# Altium schematic sheet H723ZG_Interface.SchDoc
size A; SheetNumber: 6; SheetTotal: 6
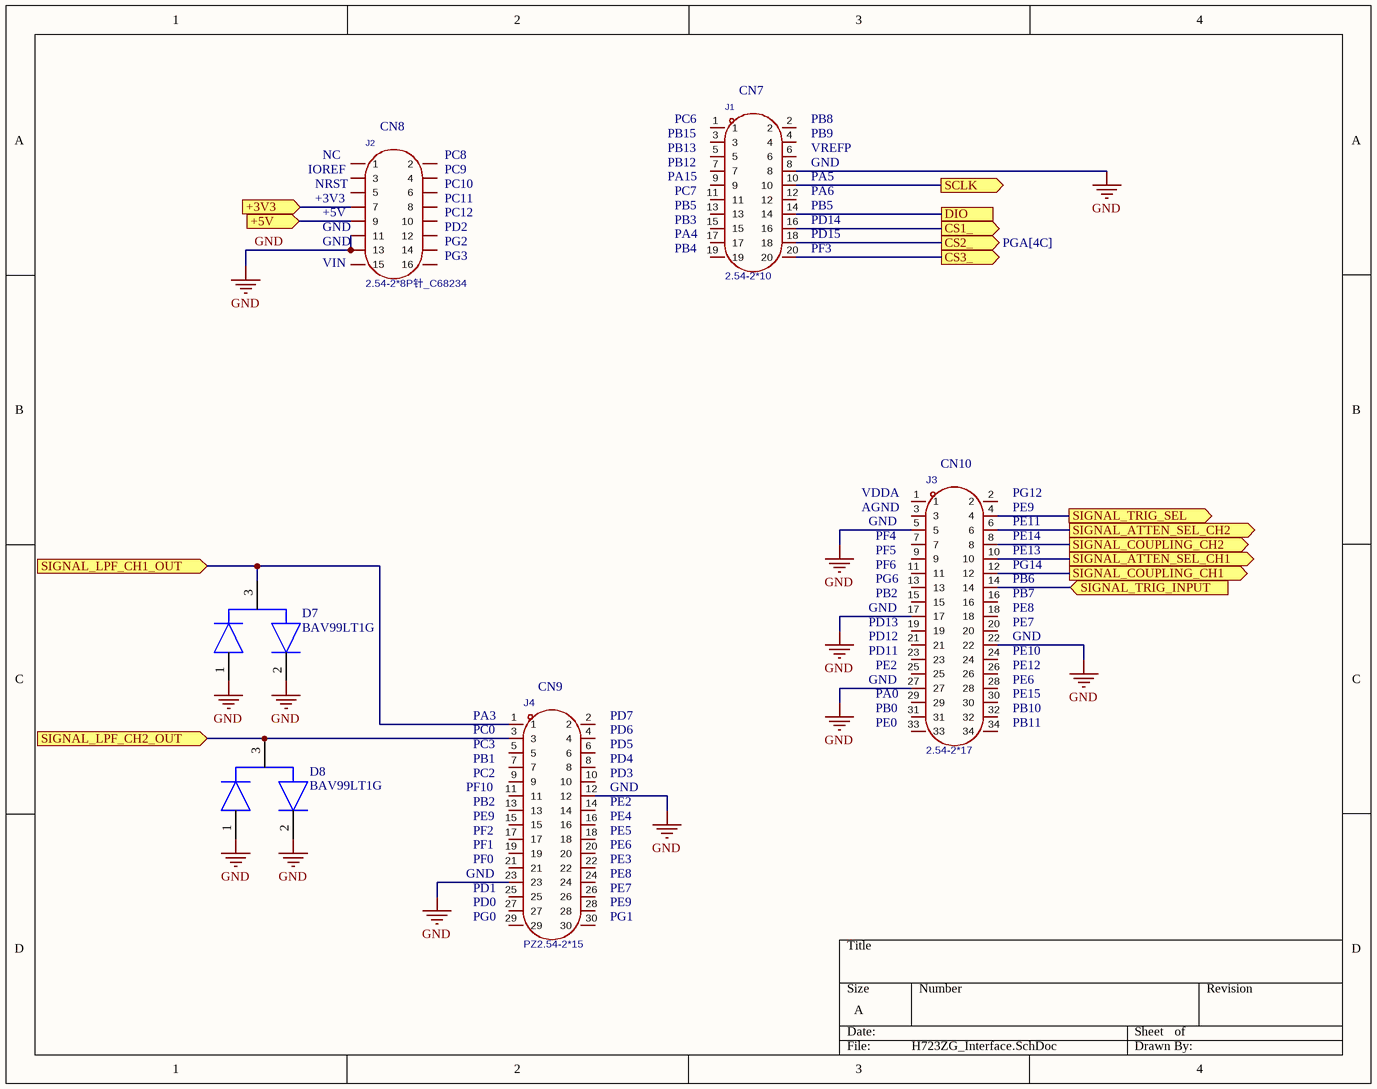
[diagram p0: H723ZG_Interface.SchDoc]

## Parts
D7  BAV99LT1G  [FP-318-08-IPC_B]
D8  BAV99LT1G  [FP-318-08-IPC_B]
J1  2.54-2*10  [HDR-TH_20P-P2.54-V-M-R2-C10-S2.54]
J2  2.54-2*8P针_C68234  [HDR-TH_16P-P2.54-V-M-R2-C8-S2.54]
J3  2.54-2*17  [HDR-TH_34P-P2.54-V-M-R2-C17-S2.54-2]
J4  PZ2.54-2*15  [HDR-TH_30P-P2.54-V-M-R2-C15-S2.54-2]

## Ports
+3V3 (in, see PGA[2A], PGA[2B], PGA[4A], PGA[4C], REF_VOLTAGE_RELAY_DRIVER[1A], REF_VOLTAGE_RELAY_DRIVER[2B], REF_VOLTAGE_RELAY_DRIVER[2C], REF_VOLTAGE_RELAY_DRIVER[4A], Trigger[1C], Trigger[3A]), +5V (in, see PGA[3A], PGA[3C], REF_VOLTAGE_RELAY_DRIVER[2C], REF_VOLTAGE_RELAY_DRIVER[3B], Trigger[2B], Trigger[4A]), CS1_ (out, see PGA[4A]), CS2_ (out, see PGA[4C]), CS3_ (out, see Trigger[1C]), DIO (see PGA[4B], PGA[4C], Trigger[1C]), SCLK (out, see PGA[4B], PGA[4C], Trigger[1C]), SIGNAL_ATTEN_SEL_CH1 (out, see REF_VOLTAGE_RELAY_DRIVER[1B]), SIGNAL_ATTEN_SEL_CH2 (out, see REF_VOLTAGE_RELAY_DRIVER[1C]), SIGNAL_COUPLING_CH1 (out, see analog_input[1B]), SIGNAL_COUPLING_CH2 (out, see analog_input[1D]), SIGNAL_LPF_CH1_OUT (in, see LPF[4A], Trigger[2B]), SIGNAL_LPF_CH2_OUT (in, see LPF[4C], Trigger[2A]), SIGNAL_TRIG_INPUT (in, see Trigger[4C]), SIGNAL_TRIG_SEL (out, see Trigger[3A])

## Nets
GND: D7.1(A) D7.2(C) D8.1(A) D8.2(C) J1.8 J2.11 J2.13 J3.5 J3.17 J3.22 J3.27 J4.12 J4.23
+3V3: J2.7 ; port +3V3
+5V: J2.9 ; port +5V
CS1_: J1.16 ; port CS1_
CS2_: J1.18 ; port CS2_
CS3_: J1.20 ; port CS3_
DIO: J1.14 ; port DIO
SCLK: J1.10 ; port SCLK
SIGNAL_ATTEN_SEL_CH1: J3.10 ; port SIGNAL_ATTEN_SEL_CH1
SIGNAL_ATTEN_SEL_CH2: J3.6 ; port SIGNAL_ATTEN_SEL_CH2
SIGNAL_COUPLING_CH1: J3.12 ; port SIGNAL_COUPLING_CH1
SIGNAL_COUPLING_CH2: J3.8 ; port SIGNAL_COUPLING_CH2
SIGNAL_LPF_CH1_OUT: D7.3(CATHODE/ANODE) J4.1 ; port SIGNAL_LPF_CH1_OUT
SIGNAL_LPF_CH2_OUT: D8.3(CATHODE/ANODE) J4.3 ; port SIGNAL_LPF_CH2_OUT
SIGNAL_TRIG_INPUT: J3.14 ; port SIGNAL_TRIG_INPUT
SIGNAL_TRIG_SEL: J3.4 ; port SIGNAL_TRIG_SEL

Not connected (* = marked no-connect by the designer): J1 1 2 3 4 5 6 7 9 11 12 13 15 17 19; J2 1 2 3 4 5 6 8 10 12 14 15 16; J3 1 2 3 7 9 11 13 15 16 18 19 20 21 23 24 25 26 28 29 30 31 32 33 34; J4 2 4 5 6 7 8 9 10 11 13 14 15 16 17 18 19 20 21 22 24 25 26 27 28 29 30

## Notes on the sheet
- (near J1) CN7
- (near J2) IOREF
- (near J2) NC
- (near J2) CN8
- (near J2) PC8
- (near J2) PC9
- (near J1) PB12
- (near J1) PB15
- (near J1) PB13
- (near J1) PC6
- (near J1) PB8
- (near J1) PB9
- (near J1) VREFP
- (near J1) GND
- (near J2) NRST
- (near J2) +3V3
- (near J2) +5V
- (near J2) GND
- (near J2) PC10
- (near J2) PC12
- (near J2) PD2
- (near J2) PG2
- (near J2) PC11
- (near J1) PA15
- (near J1) PB4
- (near J1) PA4
- (near J1) PB3
- (near J1) PB5
- (near J1) PC7
- (near J1) PD14
- (near J1) PA5
- (near J1) PA6
- (near J1) PD15
- (near J1) PF3
- (near J2) VIN
- (near J2) PG3
- (near J3) VDDA
- (near J3) AGND
- (near J3) GND
- (near J3) PF4
- (near J3) CN10
- (near J3) PE9
- (near J3) PE11
- (near J3) PE14
- (near J3) PG12
- (near J3) PF5
- (near J3) PF6
- (near J3) PG6
- (near J3) PB2
- (near J3) PE13
- (near J3) PB6
- (near J3) PB7
- (near J3) PG14
- (near J3) PD11
- (near J3) PD12
- (near J3) PD13
- (near J3) PE2
- (near J3) PE6
- (near J3) PE7
- (near J3) PE8
- (near J3) PE10
- (near J3) PE12
- (near J4) PA3
- (near J4) PC0
- (near J4) PC3
- (near J4) CN9
- (near J4) PD5
- (near J4) PD6
- (near J4) PD7
- (near J3) PA0
- (near J3) PB0
- (near J3) PE0
- (near J3) PE15
- (near J3) PB10
- (near J3) PB11
- (near J4) PF10
- (near J4) PE9
- (near J4) PB2
- (near J4) PC2
- (near J4) PB1
- (near J4) PD3
- (near J4) PD4
- (near J4) GND
- (near J4) PE2
- (near J4) PE4
- (near J4) PD1
- (near J4) PF0
- (near J4) PF1
- (near J4) PF2
- (near J4) PE3
- (near J4) PE5
- (near J4) PE6
- (near J4) PE7
- (near J4) PE8
- (near J4) PG0
- (near J4) PD0
- (near J4) PG1

## Library data of the parts
D7 D8 = CMP-07163-000036-1: DIODE ARRAY 100V 215MA SOT23-3; Capacitance: 1.5pF; Current Rating: 200mA; Max Repetitive Reverse Voltage (Vrrm): 70V; Forward Voltage: 1.25V; Max Forward Surge Current (Ifsm): 500mA; Peak Reverse Current: 2.5uA; Forward Current: 150mA; Peak Non-Repetitive Surge Current: 2A; Reverse Recovery Time: 6ns; Length: 2.9mm; Voltage Rating (DC): 70V; Case/Package: SOT-23; Height: 0.94mm; Number of Pins: 3; Mount: Surface Mount; Min Operating Temperature: -65°C; Lead Free: Lead Free; REACH SVHC: No SVHC; Width: 1.3mm; Packaging: Tape and Reel; Max Operating Temperature: 150°C
J1 = CMP-012-000002-1: Pin Structure:2x10P Pitch:2.54mm Row Spacing:2.54mm Circluar Pins/Square Pins:Pin Header Mounting Type:Through Hole Number of Rows:2 Number of Pins:20P Current Rating:2.5A Length of Mating Pin:6mm Insulation Height:2.54mm Length of End Connection Pin:3mm; Manufacturer: ZHOURI(洲日); Pin Structure: 2x10P; ConvertToPcb: yes; ModelName: HDR-TH_20P-P2.54-V-M-R2-C10-S2.54-1; Row Spacing: 2.54mm; Current Rating: 2.5A; ModelTransform: 1000.3917,199.9996,0,0,0,0,0,0,-118.11; ModelId: 7b46918fe38e4962af531f5fab9490b0聨0819f05c4eef4c71ace90d822a990e87; LCSC Part Name: 2x10P 间距:2.54mm 方针 直插; Insulation Height: 2.54mm; Length of End Connection Pin: 3mm; FootprintName: HDR-TH_20P-P2.54-V-M-R2-C10-S2.54; AddInBom: yes; Contact Plating: Gold; Device: 2.54-2*10; Supplier Footprint: 插件,P=2.54mm; Length of Mating Pin: 6mm; Mounting Type: Through Hole; Contact Material: Brass; Symbol: 2.54-2*10; Number of Pins: 20P; Circluar Pins/Square Pins: Pin Header; JLCPCB Part Class: Extended Part; Operating Temperature: -40℃~+105℃; Source: P1.SCHLIB; Number of Rows: 2; Datasheet: https://item.szlcsc.com/datasheet/2.54-2*10/5692723.html; Pitch: 2.54mm; Design Item ID: 2.54-2*10; Manufacturer Part Number: 2.54-2*10; Supplier Part Number: C5116480
J2 = CMP-012-000001-1: Pin Structure:2x8P Pitch:2.54mm Row Spacing:2.54mm Circluar Pins/Square Pins:Pin Header Mounting Type:Through Hole Number of Rows:2 Number of Pins:16P Current Rating:3A Voltage Rating (Max):- Length of Mating Pin:5.9mm Insulation Height:2.54mm Length of E; Manufacturer: BOOMELE(博穆精密); Current Rating: 3A; ModelTransform: 799.99844,200,0,0,0,0,0,0,-118.11; Pitch: 2.54mm; ModelName: HDR2.54-M-LI-2X8P; Symbol: Header-Male-2.54_2x8; ModelId: e9bbe0154d6648aeb599214ae56f6999聨0819f05c4eef4c71ace90d822a990e87; Pin Structure: 2x8P; AddInBom: yes; Number of Pins: 16P; Operating Temperature: -55℃~+105℃; Contact Material: Brass; Color: Black; Length of End Connection Pin: 3mm; Length of Mating Pin: 5.9mm; Supplier Footprint: 插件,P=2.54mm; Insulation Height: 2.54mm; Design Item ID: 2.54-2*8P针_C68234; Mounting Type: Through Hole; Voltage Rating (Max): -; Number of Rows: 2; FootprintName: HDR-TH_16P-P2.54-V-M-R2-C8-S2.54; Contact Plating: Gold; Device: 2.54-2*8P针_C68234; Datasheet: https://item.szlcsc.com/datasheet/2.54-2*8P%25E9%2592%2588/69336.html; JLCPCB Part Class: Extended Part; Row Spacing: 2.54mm; Circluar Pins/Square Pins: Pin Header; Source: P1.SCHLIB; ConvertToPcb: yes; LCSC Part Name: 2x8P 间距:2.54mm 方针 直插; Manufacturer Part Number: 2.54-2*8P针; Supplier Part Number: C68234
J3 = CMP-012-000006-1: 2.54mm pitch, 2 rows, 2*17, 34 pins total
J4 = CMP-012-000005-1: Pin Structure:2x15P Pitch:2.54mm Row Spacing:2.54mm Circluar Pins/Square Pins:Pin Header Mounting Type:Through Hole Number of Rows:2 Number of Pins:30P Current Rating:2.5A Length of Mating Pin:6mm Insulation Height:2.54mm Length of End Connection Pin:3mm; Manufacturer: ZHOURI(洲日); AddInBom: yes; Pin Structure: 2x15P; Row Spacing: 2.54mm; ModelTransform: 1500.036,196.85,0,0,0,0,0,0,-118.11; ModelId: 20e3c55689c04fa0b6843741cd965711聨0819f05c4eef4c71ace90d822a990e87; Current Rating: 2.5A; Number of Rows: 2; Datasheet: https://item.szlcsc.com/datasheet/PZ2.54-2*15/5925192.html; FootprintName: HDR-TH_30P-P2.54-V-M-R2-C15-S2.54-2; ConvertToPcb: yes; Device: PZ2.54-2*15; Pitch: 2.54mm; Mounting Type: Through Hole; Length of End Connection Pin: 3mm; Length of Mating Pin: 6mm; LCSC Part Name: 2x15P 间距:2.54mm 方针 直插; Contact Material: Brass; Design Item ID: PZ2.54-2*15; JLCPCB Part Class: Extended Part; Insulation Height: 2.54mm; Operating Temperature: -40℃~+105℃; Source: P1.SCHLIB; Supplier Footprint: 插件,P=2.54mm; Contact Plating: Gold; Symbol: PZ2.54-2*15; ModelName: HDR-TH_30P-P2.54-V-M-R2-C15-S2.54-2; Number of Pins: 30P; Circluar Pins/Square Pins: Pin Header; Manufacturer Part Number: PZ2.54-2*15; Supplier Part Number: C5224013